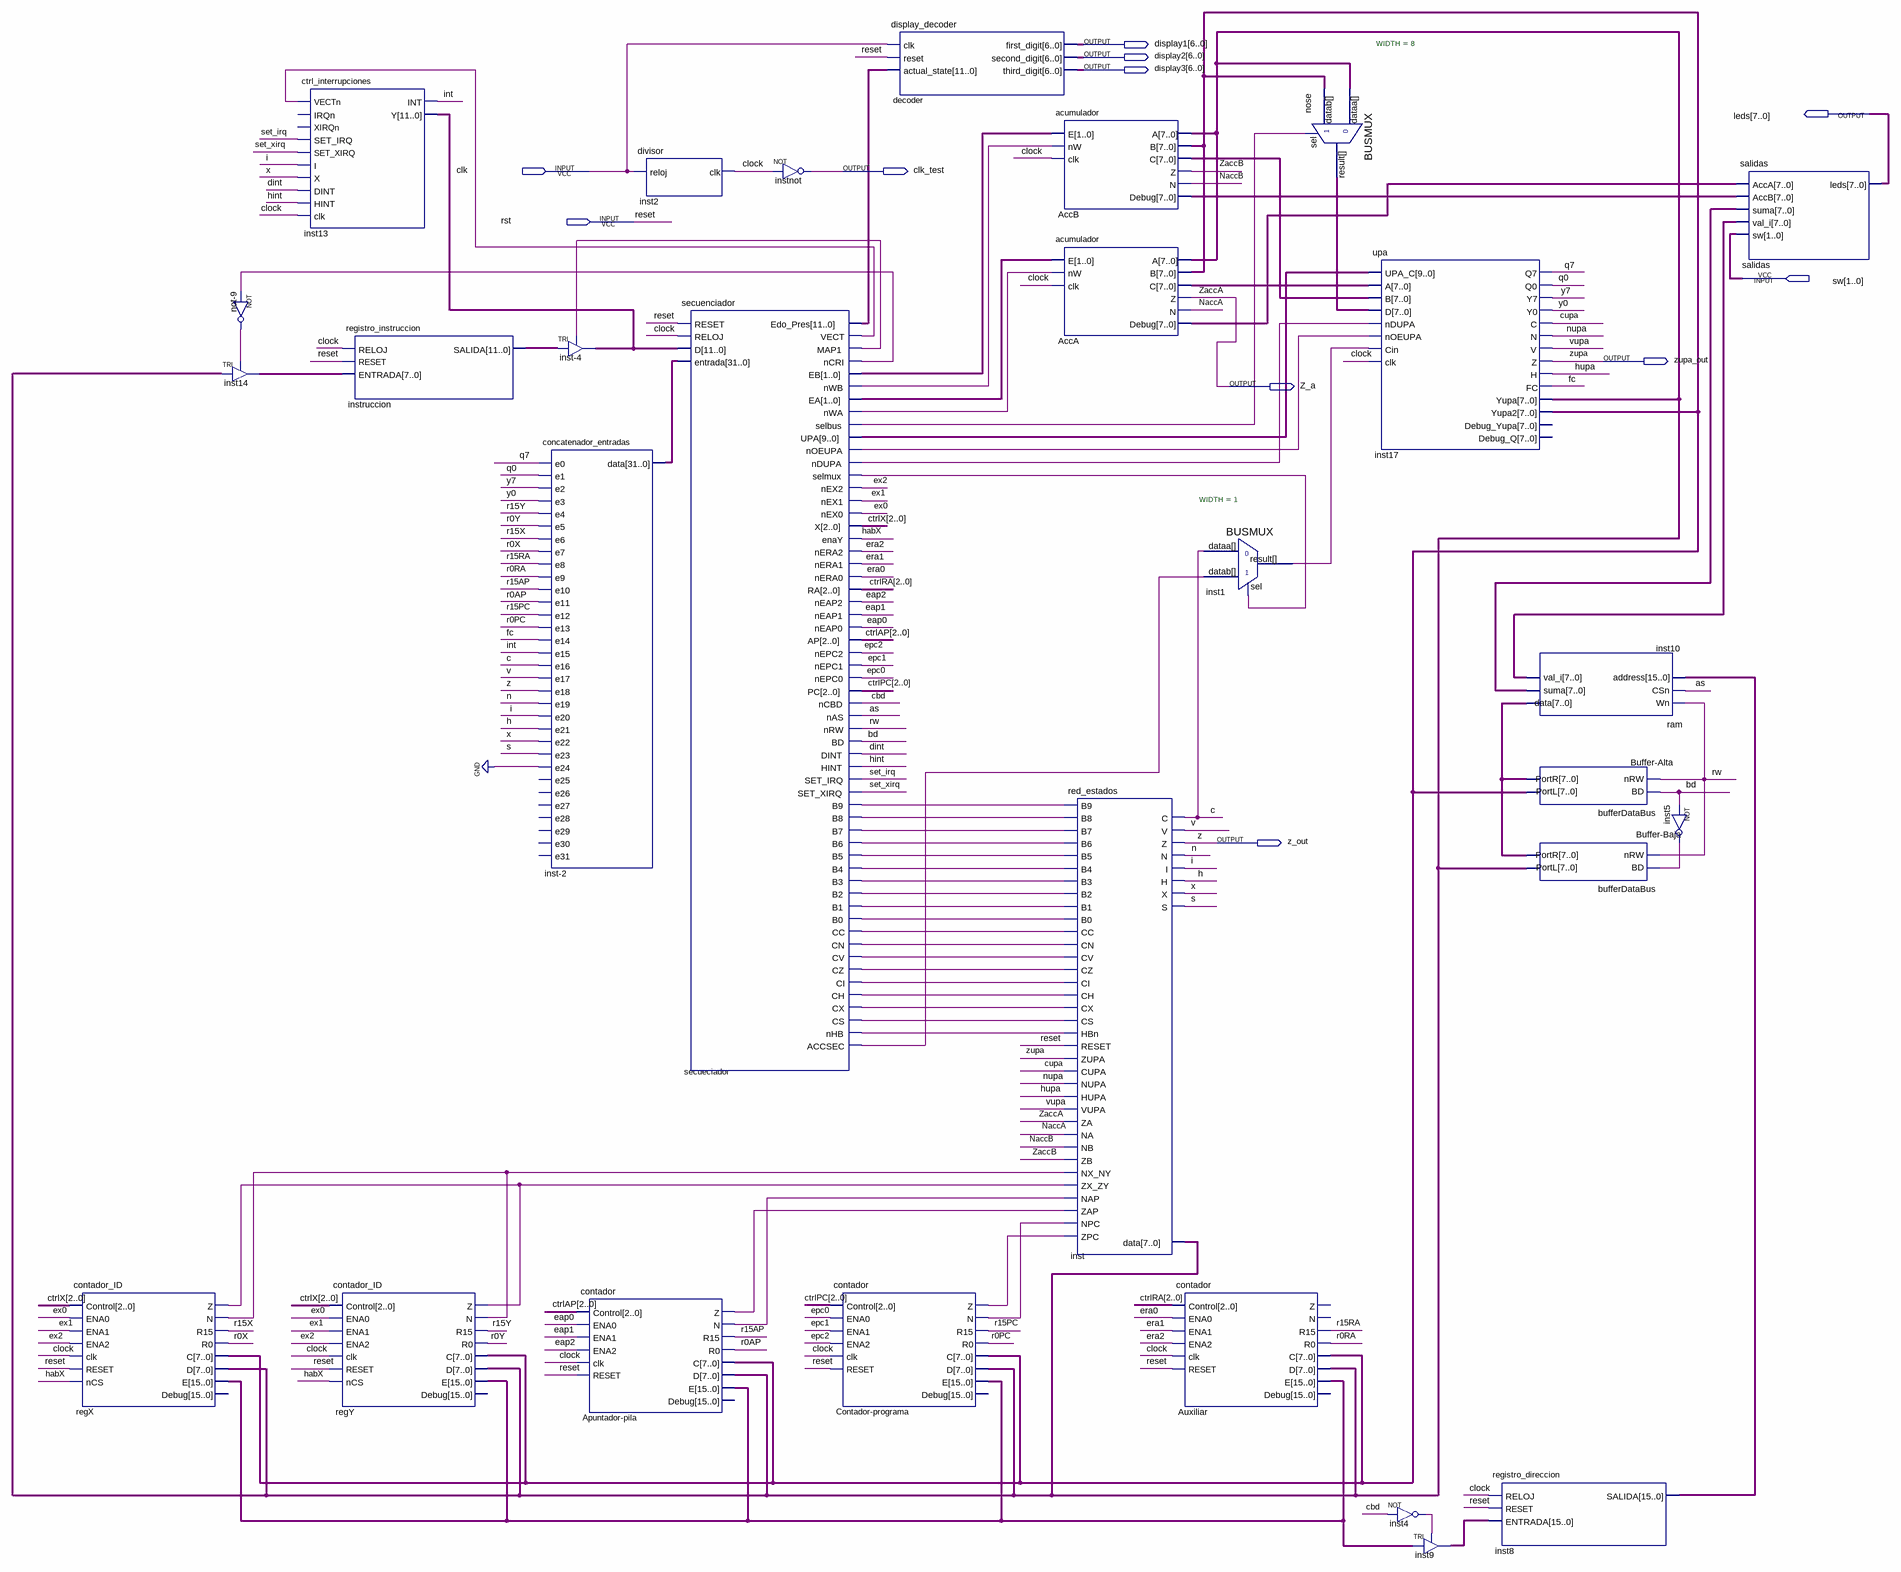
[diagram p0: schematic sheet]
// Quartus schematic cisc.bdf as structural Verilog: 29 symbols, 11 pins
module cisc (
  input  clk,
  input  rst,
  input  [1:0] sw,
  output [6:0] display1,
  output [6:0] display2,
  output [6:0] display3,
  output [7:0] leds,
  output clk_test,
  output zupa_out,
  output Z_a,
  output z_out
);

  wire Apuntador_pila_n, Apuntador_pila_z, as, bd, c, cbd, clock, Contador_programa_n, Contador_programa_z,
       cupa, dint, eap0, eap1, eap2, epc0, epc1, epc2, era0, era1, era2, ex0, ex1, ex2, fc, h, habX, hint,
       hupa, i, inst1_result, inst4_out, inst5_out, \int , n, NaccA, NaccB, not_9_out, nupa, q0, q7, r0AP,
       r0PC, r0RA, r0X, r0Y, r15AP, r15PC, r15RA, r15X, r15Y, regX_n, regX_z, rw, s, secueciador_accsec,
       secueciador_b0, secueciador_b1, secueciador_b2, secueciador_b3, secueciador_b4, secueciador_b5,
       secueciador_b6, secueciador_b7, secueciador_b8, secueciador_b9, secueciador_cc, secueciador_ch,
       secueciador_ci, secueciador_cn, secueciador_cs, secueciador_cv, secueciador_cx, secueciador_cz,
       secueciador_map1, secueciador_ncri, secueciador_ndupa, secueciador_nhb, secueciador_noeupa,
       secueciador_nwa, secueciador_nwb, secueciador_selbus, secueciador_selmux, secueciador_vect, set_irq,
       set_xirq, v, vupa, x, y0, y7, ZaccB;
  wire [1:0] secueciador_ea, secueciador_eb;
  wire [2:0] ctrlAP, ctrlPC, ctrlRA, ctrlX;
  wire [7:0] AccA_c, AccA_debug, AccB_c, AccB_debug, inst10_data, inst10_suma, inst10_val_i, inst14_out,
       nose_result, regX_c, regX_d;
  wire [9:0] secueciador_upa;
  wire [11:0] inst13_y, instruccion_salida, secueciador_edo_pres;
  wire [15:0] inst8_salida, inst9_out, regX_e;
  wire [31:0] inst_2_data;

  contador_ID regX (
    .Control(ctrlX), .ENA0(ex0), .ENA1(ex1), .ENA2(ex2), .clk(clock), .RESET(rst), .nCS(habX), .Z(regX_z),
    .N(regX_n), .E(regX_e), .R15(r15X), .R0(r0X), .C(regX_c), .D(regX_d));  // open: Debug
  not \not-9  (not_9_out, secueciador_ncri);
  TRI inst14[7:0] (.IN(regX_d), .OE(not_9_out), .OUT(inst14_out));
  ctrl_interrupciones inst13 (
    .VECTn(secueciador_vect), .SET_IRQ(set_irq), .SET_XIRQ(set_xirq), .I(i), .X(x), .DINT(dint), .HINT(hint),
    .clk(clock), .INT(\int ), .Y(inst13_y));  // open: IRQn, XIRQn
  registro_instruccion instruccion (.RELOJ(clock), .RESET(rst), .ENTRADA(inst14_out), .SALIDA(instruccion_salida));
  contador_ID regY (
    .Control(ctrlX), .ENA0(ex0), .ENA1(ex1), .ENA2(ex2), .clk(clock), .RESET(rst), .nCS(habX), .Z(regX_z),
    .N(regX_n), .E(regX_e), .R15(r15Y), .R0(r0Y), .C(regX_c), .D(regX_d));  // open: Debug
  TRI \inst-4 [11:0] (.IN(instruccion_salida), .OE(secueciador_map1), .OUT(inst13_y));
  concatenador_entradas \inst-2  (
    .e0(q7), .e1(q0), .e2(y7), .e3(y0), .e4(r15Y), .e5(r0Y), .e6(r15X), .e7(r0X), .e8(r15RA), .e9(r0RA),
    .e10(r15AP), .e11(r0AP), .e12(r15PC), .e13(r0PC), .e14(fc), .e15(\int ), .e16(c), .e17(v), .e18(z_out),
    .e19(n), .e20(i), .e21(h), .e22(x), .e23(s), .e24(1'b0), .data(inst_2_data));  // open: e25, e26, e27, e28, e29, e30, e31
  contador \Apuntador-pila  (
    .Control(ctrlAP), .ENA0(eap0), .ENA1(eap1), .ENA2(eap2), .clk(clock), .RESET(rst), .Z(Apuntador_pila_z),
    .N(Apuntador_pila_n), .E(regX_e), .R15(r15AP), .R0(r0AP), .C(regX_c), .D(regX_d));  // open: Debug
  divisor inst2 (.reloj(clk), .clk(clock));
  secuenciador secueciador (
    .RESET(rst), .RELOJ(clock), .D(inst13_y), .entrada(inst_2_data), .Edo_Pres(secueciador_edo_pres),
    .VECT(secueciador_vect), .MAP1(secueciador_map1), .nCRI(secueciador_ncri), .EB(secueciador_eb),
    .nWB(secueciador_nwb), .EA(secueciador_ea), .nWA(secueciador_nwa), .selbus(secueciador_selbus),
    .UPA(secueciador_upa), .nOEUPA(secueciador_noeupa), .nDUPA(secueciador_ndupa),
    .selmux(secueciador_selmux), .nEX2(ex2), .nEX1(ex1), .nEX0(ex0), .X(ctrlX), .enaY(habX), .nERA2(era2),
    .nERA1(era1), .nERA0(era0), .RA(ctrlRA), .nEAP2(eap2), .nEAP1(eap1), .nEAP0(eap0), .AP(ctrlAP),
    .nEPC2(epc2), .nEPC1(epc1), .nEPC0(epc0), .PC(ctrlPC), .nCBD(cbd), .nAS(as), .nRW(rw), .BD(bd),
    .DINT(dint), .HINT(hint), .SET_IRQ(set_irq), .SET_XIRQ(set_xirq), .B9(secueciador_b9),
    .B8(secueciador_b8), .B7(secueciador_b7), .B6(secueciador_b6), .B5(secueciador_b5), .B4(secueciador_b4),
    .B3(secueciador_b3), .B2(secueciador_b2), .B1(secueciador_b1), .B0(secueciador_b0), .CC(secueciador_cc),
    .CN(secueciador_cn), .CV(secueciador_cv), .CZ(secueciador_cz), .CI(secueciador_ci), .CH(secueciador_ch),
    .CX(secueciador_cx), .CS(secueciador_cs), .nHB(secueciador_nhb), .ACCSEC(secueciador_accsec));
  not instnot (clk_test, clock);
  contador \Contador-programa  (
    .Control(ctrlPC), .ENA0(epc0), .ENA1(epc1), .ENA2(epc2), .clk(clock), .RESET(rst),
    .Z(Contador_programa_z), .N(Contador_programa_n), .E(regX_e), .R15(r15PC), .R0(r0PC), .C(regX_c),
    .D(regX_d));  // open: Debug
  display_decoder decoder (
    .clk(clk), .reset(rst), .actual_state(secueciador_edo_pres), .first_digit(display1),
    .second_digit(display2), .third_digit(display3));
  acumulador AccB (
    .E(secueciador_eb), .nW(secueciador_nwb), .clk(clock), .Z(ZaccB), .N(NaccB), .Debug(AccB_debug),
    .A(regX_d), .B(regX_c), .C(AccB_c));
  acumulador AccA (
    .E(secueciador_ea), .nW(secueciador_nwa), .clk(clock), .Z(Z_a), .N(NaccA), .Debug(AccA_debug),
    .A(regX_d), .B(regX_c), .C(AccA_c));
  red_estados inst (
    .CC(secueciador_cc), .RESET(rst), .HBn(secueciador_nhb), .B0(secueciador_b0), .CUPA(cupa),
    .CV(secueciador_cv), .B2(secueciador_b2), .B1(secueciador_b1), .VUPA(vupa), .CZ(secueciador_cz),
    .B5(secueciador_b5), .B4(secueciador_b4), .B3(secueciador_b3), .CN(secueciador_cn), .ZUPA(zupa_out),
    .ZA(Z_a), .ZB(ZaccB), .ZX_ZY(regX_z), .ZAP(Apuntador_pila_z), .ZPC(Contador_programa_z),
    .CI(secueciador_ci), .B8(secueciador_b8), .B7(secueciador_b7), .CH(secueciador_ch), .B6(secueciador_b6),
    .NUPA(nupa), .NA(NaccA), .NB(NaccB), .NX_NY(regX_n), .NAP(Apuntador_pila_n), .NPC(Contador_programa_n),
    .CX(secueciador_cx), .B9(secueciador_b9), .CS(secueciador_cs), .HUPA(hupa), .C(c), .V(v), .Z(z_out),
    .N(n), .I(i), .H(h), .X(x), .S(s), .data(regX_d));
  BUSMUX #(.WIDTH(1)) inst1 (.datab(secueciador_accsec), .sel(secueciador_selmux), .dataa(c), .result(inst1_result));
  contador Auxiliar (
    .Control(ctrlRA), .ENA0(era0), .ENA1(era1), .ENA2(era2), .clk(clock), .RESET(rst), .E(regX_e),
    .R15(r15RA), .R0(r0RA), .C(regX_c), .D(regX_d));  // open: Z, N, Debug
  BUSMUX #(.WIDTH(8)) nose (.datab(regX_c), .sel(secueciador_selbus), .dataa(regX_d), .result(nose_result));
  upa inst17 (
    .UPA_C(secueciador_upa), .A(AccA_c), .B(AccB_c), .D(nose_result), .nDUPA(secueciador_ndupa),
    .nOEUPA(secueciador_noeupa), .Cin(inst1_result), .clk(clock), .Q7(q7), .Q0(q0), .Y7(y7), .Y0(y0),
    .C(cupa), .N(nupa), .V(vupa), .Z(zupa_out), .H(hupa), .FC(fc), .Yupa(regX_d), .Yupa2(regX_c));  // open: Debug_Yupa, Debug_Q
  not inst4 (inst4_out, cbd);
  TRI inst9[15:0] (.IN(regX_e), .OE(inst4_out), .OUT(inst9_out));
  registro_direccion inst8 (.RELOJ(clock), .RESET(rst), .ENTRADA(inst9_out), .SALIDA(inst8_salida));
  ram inst10 (.Wn(rw), .CSn(as), .address(inst8_salida), .suma(inst10_suma), .val_i(inst10_val_i), .data(inst10_data));
  bufferDataBus \Buffer-Alta  (.BD(bd), .nRW(rw), .PortL(regX_c), .PortR(inst10_data));
  bufferDataBus \Buffer-Baja  (.BD(inst5_out), .nRW(rw), .PortL(regX_d), .PortR(inst10_data));
  not inst5 (inst5_out, bd);
  salidas salidas (
    .AccA(AccA_debug), .AccB(AccB_debug), .suma(inst10_suma), .val_i(inst10_val_i), .sw(sw), .leds(leds));

  // Other names for the same wires on the sheet: reset = rst; z = z_out; ZaccA = Z_a; zupa = zupa_out
endmodule
